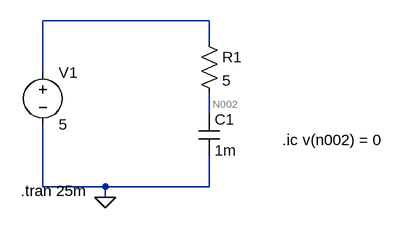
[diagram p0: schematic RC2.asc]
RC2.asc, the LTspice schematic file:
Version 4
SHEET 1 880 680
WIRE 272 32 16 32
WIRE 272 64 272 32
WIRE 16 112 16 32
WIRE 272 176 272 144
WIRE 16 288 16 192
WIRE 112 288 16 288
WIRE 272 288 272 240
WIRE 272 288 112 288
WIRE 112 304 112 288
FLAG 112 304 0
SYMBOL voltage 16 96 R0
WINDOW 123 0 0 Left 2
WINDOW 39 0 0 Left 2
SYMATTR InstName V1
SYMATTR Value 5
SYMBOL cap 256 176 R0
SYMATTR InstName C1
SYMATTR Value 1m
SYMBOL res 256 48 R0
SYMATTR InstName R1
SYMATTR Value 5
TEXT 384 216 Left 2 !.ic v(n002) = 0
TEXT -18 294 Left 2 !.tran 25m

The netlist it stands for:
* RC2.asc
V1 N001 0 5
C1 N002 0 1m
R1 N001 N002 5
.ic v(n002) = 0
.tran 25m
.backanno
.end

* Results of the author's LTspice run, read from the files saved beside the schematic
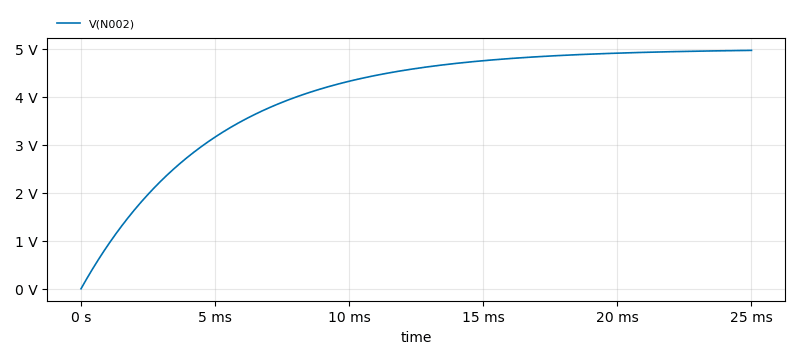
[diagram p1: Transient Analysis of RC2.asc, plotted from the saved traces]
* Transient Analysis, 1 run:
*   V(N002): min 0 V, max 4.966 V, average 4.007 V, rms 4.191 V, last 4.966 V